# EAGLE design V0p2_Main_PCB2 (EAGLE 7.1.0)
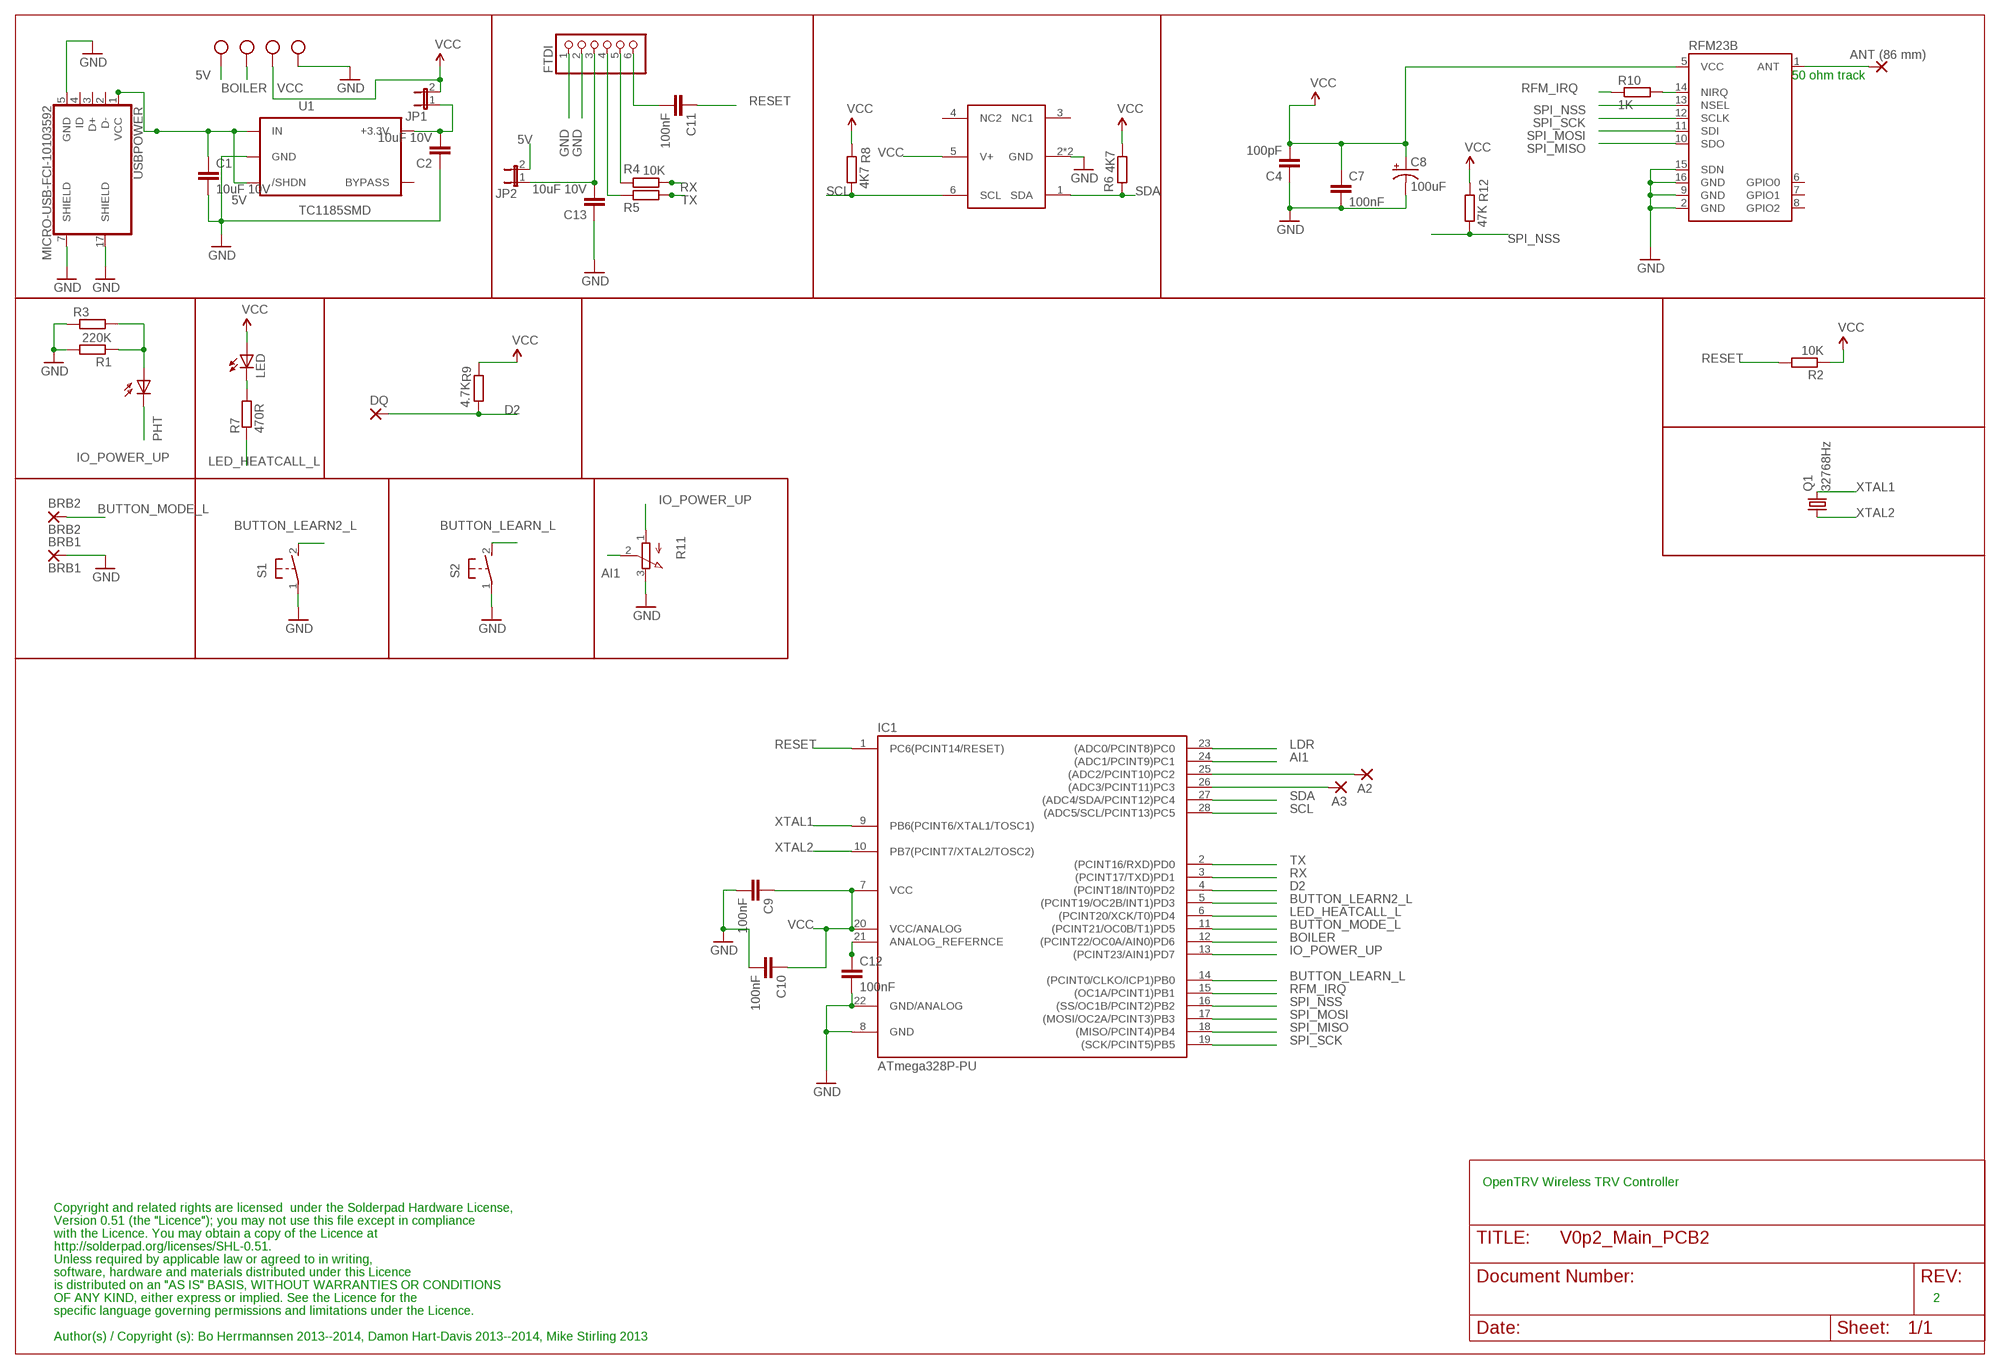
[diagram p0: schematic, sheet 1]

## Parts
A2  2,15/1,0  [2,15/1,0]
A3  2,15/1,0  [2,15/1,0]
ANT1  ANT (86 mm)  2,15/1,0  [2,15/1,0]
BRB1  BRB1  2,15/1,0  [2,15/1,0]
BRB2  BRB2  2,15/1,0  [2,15/1,0]
C1  10uF 10V  C-EUC0603  [C0603]
C2  10uF 10V  C-EUC0603  [C0603]
C4  100pF  C-EUC0603  [C0603]
C7  100nF  C-EUC0603  [C0603]
C8  100uF  CAP_POL1206  [EIA3216]
C9  100nF  C-EUC0603  [C0603]
C10  100nF  C-EUC0603  [C0603]
C11  100nF  C-EUC0603  [C0603]
C12  100nF  C-EUC0603  [C0603]
C13  10uF 10V  C-EUC0603  [C0603]
DQ  2,15/1,0  [2,15/1,0]
FTDI  PINHD-1X6/90  [1X06/90]
IC1  ATmega328P-PU  ATMEGA168-PU  [DIL28-3]
JP1  JP1E  [JP1]
JP2  JP1E  [JP1]
LED  LED3MM  [LED3MM]
PHT  BPX65  [BPX65]
Q1  32768Hz  MC-306  [MC-306]
R1  220K  R-EU_R0603  [R0603]
R2  10K  R-EU_R0603  [R0603]
R3  R-EU_0309/V  [0309V]
R4  10K  R-EU_R0603  [R0603]
R5  10K  R-EU_R0603  [R0603]
R6  4K7  R-EU_R0603  [R0603]
R7  470R  R-EU_R0603  [R0603]
R8  4K7  R-EU_R0603  [R0603]
R9  4.7K  R-EU_R0603  [R0603]
R10  1K  R-EU_R0603  [R0603]
R11  EVUE2A  [EVUE]
R12  47K  R-EU_R0603  [R0603]
RFM23B  RFM23B  [RFM23-XXX-S1]
S1  31-XX  [B3F-31XX]
S2  31-XX  [B3F-31XX]
U1  TC1185SMD  [TC1185]
U$4  SHT21  [SHT21]
USBPOWER  MICRO-USB-FCI-10103592  [MICRO-USB-FCI-10103592]
X1  W237-102  [SCREWTERMINAL]
X2  W237-102  [SCREWTERMINAL]

## Nets
5V [supply]: C1.1 JP2.2 U1.1(IN) U1.3(/SHDN) USBPOWER.1(VCC) X1.2
AI1: IC1.24((ADC1/PCINT9)PC1) R11.2(S)
BOILER: IC1.12((PCINT22/OC0A/AIN0)PD6) X1.1
BUTTON_LEARN2_L: IC1.5((PCINT19/OC2B/INT1)PD3) S1.2(S)
BUTTON_LEARN_L: IC1.14((PCINT0/CLKO/ICP1)PB0) S2.2(S)
BUTTON_MODE_L: BRB2.1(P) IC1.11((PCINT21/OC0B/T1)PD5)
D2: DQ.1(P) IC1.4((PCINT18/INT0)PD2) R9.1
GND [supply]: BRB1.1(P) C1.2 C2.1 C4.1 C7.2 C8.C(-) C9.2 C10.2 C12.2 C13.1 FTDI.1 FTDI.2 IC1.8(GND) IC1.22(GND/ANALOG) R1.2 R3.1 R11.3(E) RFM23B.2(GND) RFM23B.9(GND) RFM23B.15(SDN) RFM23B.16(GND) S1.1(P) S2.1(P) U1.2(GND) U$4.2(GND) U$4.P$1(GND) USBPOWER.5(GND) USBPOWER.7(SHIELD) USBPOWER.17(SHIELD) X2.2
IO_POWER_UP [supply]: IC1.13((PCINT23/AIN1)PD7) PHT.K(C) R11.1(A)
LDR: IC1.23((ADC0/PCINT8)PC0) PHT.A R1.1 R3.2
LED_HEATCALL_L: IC1.6((PCINT20/XCK/T0)PD4) R7.1
N$1: C11.2 FTDI.6
N$3: FTDI.4 R5.2
N$5: FTDI.5 R4.2
N$6 [supply]: C12.1 IC1.21(ANALOG_REFERNCE)
N$7: R10.2 RFM23B.14(NIRQ)
N$8 [supply]: C2.2 JP1.1 U1.5(+3.3V)
N$11 [supply]: C13.2 FTDI.3 JP2.1
N$13: LED.K(C) R7.2
N$24: A2.1(P) IC1.25((ADC2/PCINT10)PC2)
N$25: A3.1(P) IC1.26((ADC3/PCINT11)PC3)
N$31 [ant]: ANT1.1(P) RFM23B.1(ANT)
RESET: C11.1 IC1.1(PC6(PCINT14/RESET)) R2.2
RFM_IRQ: IC1.15((OC1A/PCINT1)PB1) R10.1
RX: IC1.3((PCINT17/TXD)PD1) R4.1
SCL: IC1.28((ADC5/SCL/PCINT13)PC5) R8.1 U$4.6(SCL)
SDA: IC1.27((ADC4/SDA/PCINT12)PC4) R6.2 U$4.1(SDA)
SPI_MISO: IC1.18((MISO/PCINT4)PB4) RFM23B.10(SDO)
SPI_MOSI: IC1.17((MOSI/OC2A/PCINT3)PB3) RFM23B.11(SDI)
SPI_NSS: IC1.16((SS/OC1B/PCINT2)PB2) R12.1 RFM23B.13(NSEL)
SPI_SCK: IC1.19((SCK/PCINT5)PB5) RFM23B.12(SCLK)
TX: IC1.2((PCINT16/RXD)PD0) R5.1
VCC [supply]: C4.2 C7.1 C8.A(+) C9.1 C10.1 IC1.7(VCC) IC1.20(VCC/ANALOG) JP1.2 LED.A R2.1 R6.1 R8.2 R9.2 R12.2 RFM23B.5(VCC) U$4.5(V+) X2.1
XTAL1: IC1.9(PB6(PCINT6/XTAL1/TOSC1)) Q1.4
XTAL2: IC1.10(PB7(PCINT7/XTAL2/TOSC2)) Q1.1
Unconnected: RFM23B.6(GPIO0) RFM23B.7(GPIO1) RFM23B.8(GPIO2) U1.4(BYPASS) U$4.3(NC1) U$4.4(NC2) USBPOWER.2(D-) USBPOWER.3(D+) USBPOWER.4(ID)

## Notes on the sheet
- 50 ohm track
- OpenTRV Wireless TRV Controller
- Copyright and related rights are licensed  under the Solderpad Hardware License,
- Version 0.51 (the "Licence"); you may not use this file except in compliance
- with the Licence. You may obtain a copy of the Licence at
- http://solderpad.org/licenses/SHL-0.51.
- Unless required by applicable law or agreed to in writing,
- software, hardware and materials distributed under this Licence
- is distributed on an "AS IS" BASIS, WITHOUT WARRANTIES OR CONDITIONS
- OF ANY KIND, either express or implied. See the Licence for the | 2
- specific language governing permissions and limitations under the Licence.
- Author(s) / Copyright (s): Bo Herrmannsen 2013--2014, Damon Hart-Davis 2013--2014, Mike Stirling 2013

## Library data of the parts
A2 A3 ANT1 BRB1 BRB2 DQ = wirepad:2,15/1,0: THROUGH-HOLE PAD
C1 C2 C4 C7 C9-C13 = resistor:C-EU: CAPACITOR, European symbol
C8 = SparkFun-Passives:CAP_POL: Capacitor Polarized These are standard SMD and PTH capacitors. Normally 10uF, 47uF, and 100uF in electrolytic and tantalum varieties. Always verify the external diameter of the through hole cap, it varies with capacity, voltage, and manufacturer. The EIA devices should be standard.
FTDI = pinhead:PINHD-1X6: PIN HEADER
IC1 = Arduino-AVR:ATMEGA168-PU
JP1 JP2 = jumper:JP1E: JUMPER
LED = adafruit:LED: LED OSRAM: - CHIPLED LG R971, LG N971, LY N971, LG Q971, LY Q971, LO R971, LY R971 LH N974, LH R974 LS Q976, LO Q976, LY Q976 LO Q996 - Hyper CHIPLED LW Q18S LB Q993, LB Q99A, LB R99A - SideLED LS A670, LO A670, LY A670, LG A670, LP A670 LB A673, LV A673, LT A673, LW A673 LH A674 LY A675 LS A676, LA A676, LO A676, LY A676, LW A676 LS A679, LY A679, LG A679 - Hyper Micro SIDELED® LS Y876, LA Y876, LO Y876, LY Y876 LT Y87S - SmartLED LW L88C, LW L88S LB L89C, LB L89S, LG L890 LS L89K, LO L89K, LY L89K LS L896, LA L896, LO L896, LY L896 - TOPLED LS T670, LO T670, LY T670, LG T670, LP T670 LSG T670, LSP T670, LSY T670, LOP T670, LYG T670 LG T671, LOG T671, LSG T671 LB T673, LV T673, LT T673, LW T673 LH T674 LS T676, LA T676, LO T676, LY T676, LB T676, LH T676, LSB T676, LW T676 LB T67C, LV T67C, LT T67C, LS T67K, LO T67K, LY T67K, LW E67C LS E67B, LA E67B, LO E67B, LY E67B, LB E67C, LV E67C, LT E67C LW T67C LS T679, LY T679, LG T679 LS T770, LO T770, LY T770, LG T770, LP T770 LB T773, LV T773, LT T773, LW T773 LH T774 LS E675, LA E675, LY E675, LS T675 LS T776, LA T776, LO T776, LY T776, LB T776 LHGB T686 LT T68C, LB T68C - Hyper Mini TOPLED® LB M676 - Mini TOPLED Santana® LG M470 LS M47K, LO M47K, LY M47K Source: http://www.osram.convergy.de/
PHT = opto-trans-siemens:BPX65: PHOTO DIODE; MPN: BPX65.; OC_FARNELL: 327451; OC_NEWARK: 06WX2764
Q1 = crystal:MC-306: kHz RANGE CRYSTAL UNIT SMD Source: MC-306_405_406_E07X.PDF Homepage <http://www.epsontoyocom.co.jp>; MPN: MC-306 60.0KHZ 100PPM ,12.5PF; OC_FARNELL: 1278040; OC_NEWARK: 31M5576
R1-R10 R12 = resistor:R-EU_: RESISTOR, European symbol
R11 = pot:EVU: 9 mm Square Rotary Potentiometers Source: Panasonic
RFM23B = SparkFun-RF:RFM23B
S1 S2 = adafruit:31-XX: OMRON SWITCH Now with beefier pads!
U1 = 3.3VREG:TC1185
U$4 = SHT21:SHT21: Tempsensor RS No: 709-8868 MRF No: TMP112AIDRLT
USBPOWER = micro-usb-fci-10103592:MICRO-USB-FCI-10103592: Micro USB B Connector RS No: 714-2334 MRF No: 10103592-0001LF
X1 X2 = screwterminal:W237-102: Screw terminal 3.5mm Pitch RS No: 710-0444 MRF No:1776275-2; MPN: 237-102; OC_FARNELL: unknown; OC_NEWARK: 70K9898

## Net classes
0 default: width 0.203 mm
1 supply: width 0.406 mm, clearance 0.203 mm
2 ant: width 2.184 mm

## Board
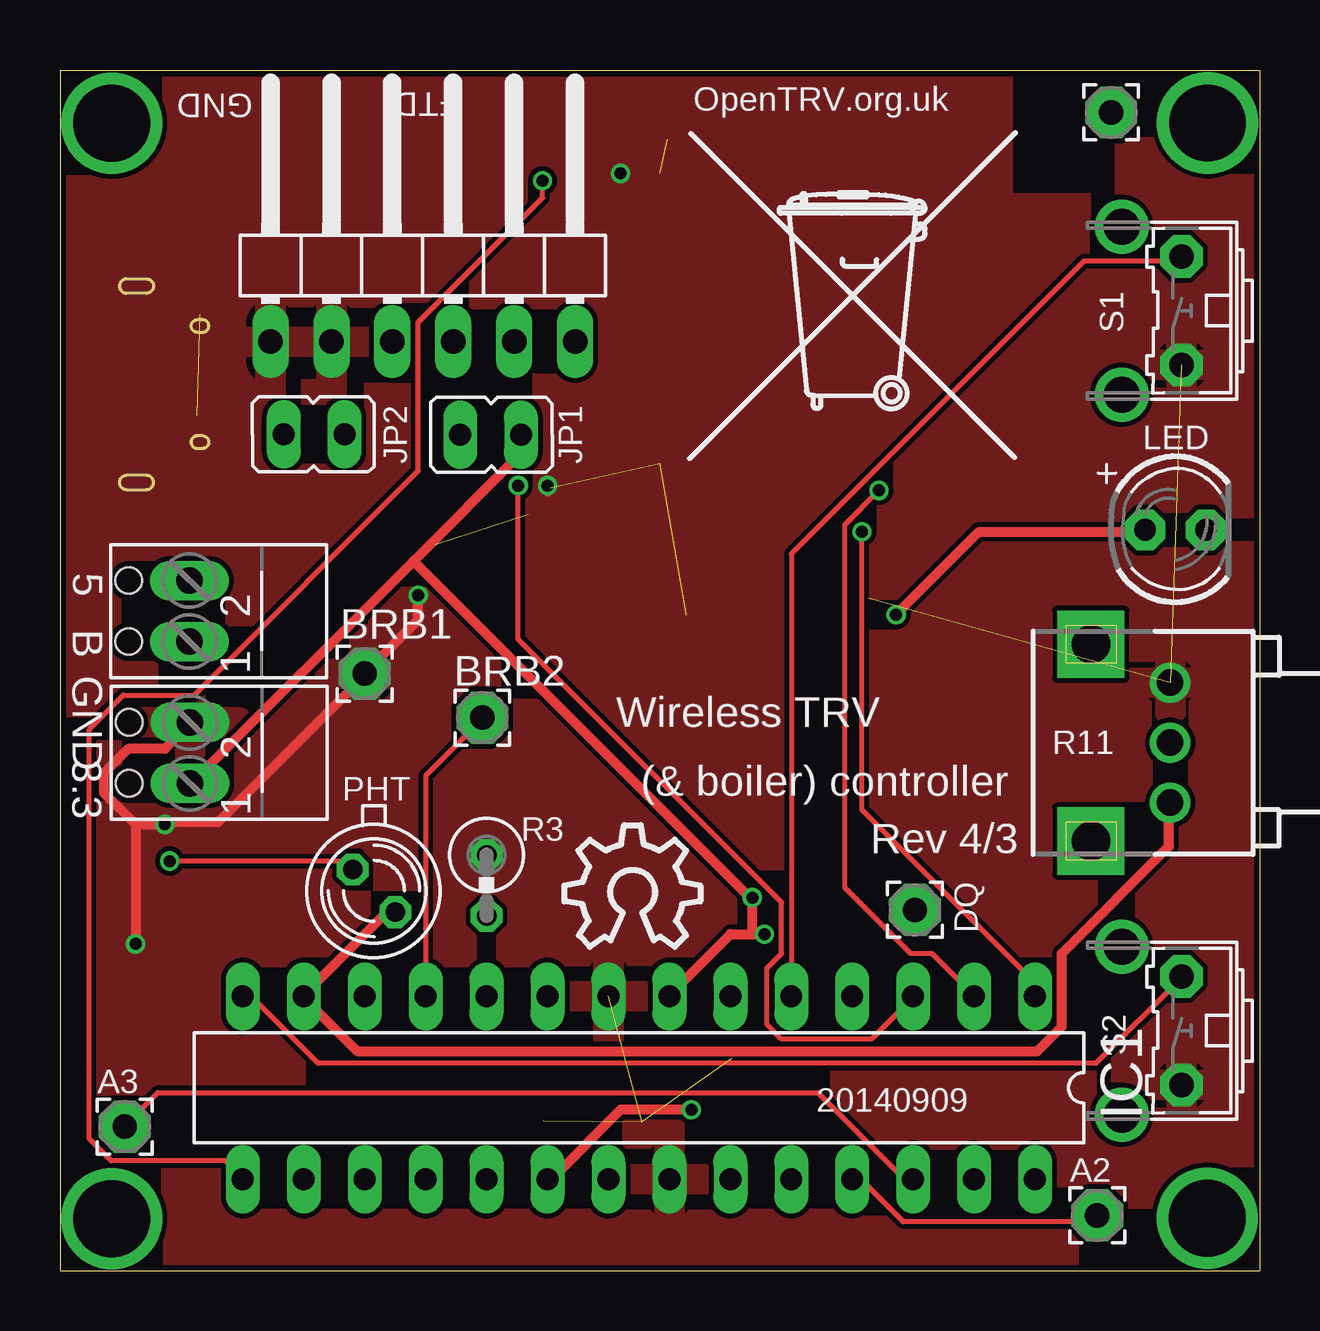
[diagram p1: board, top side]
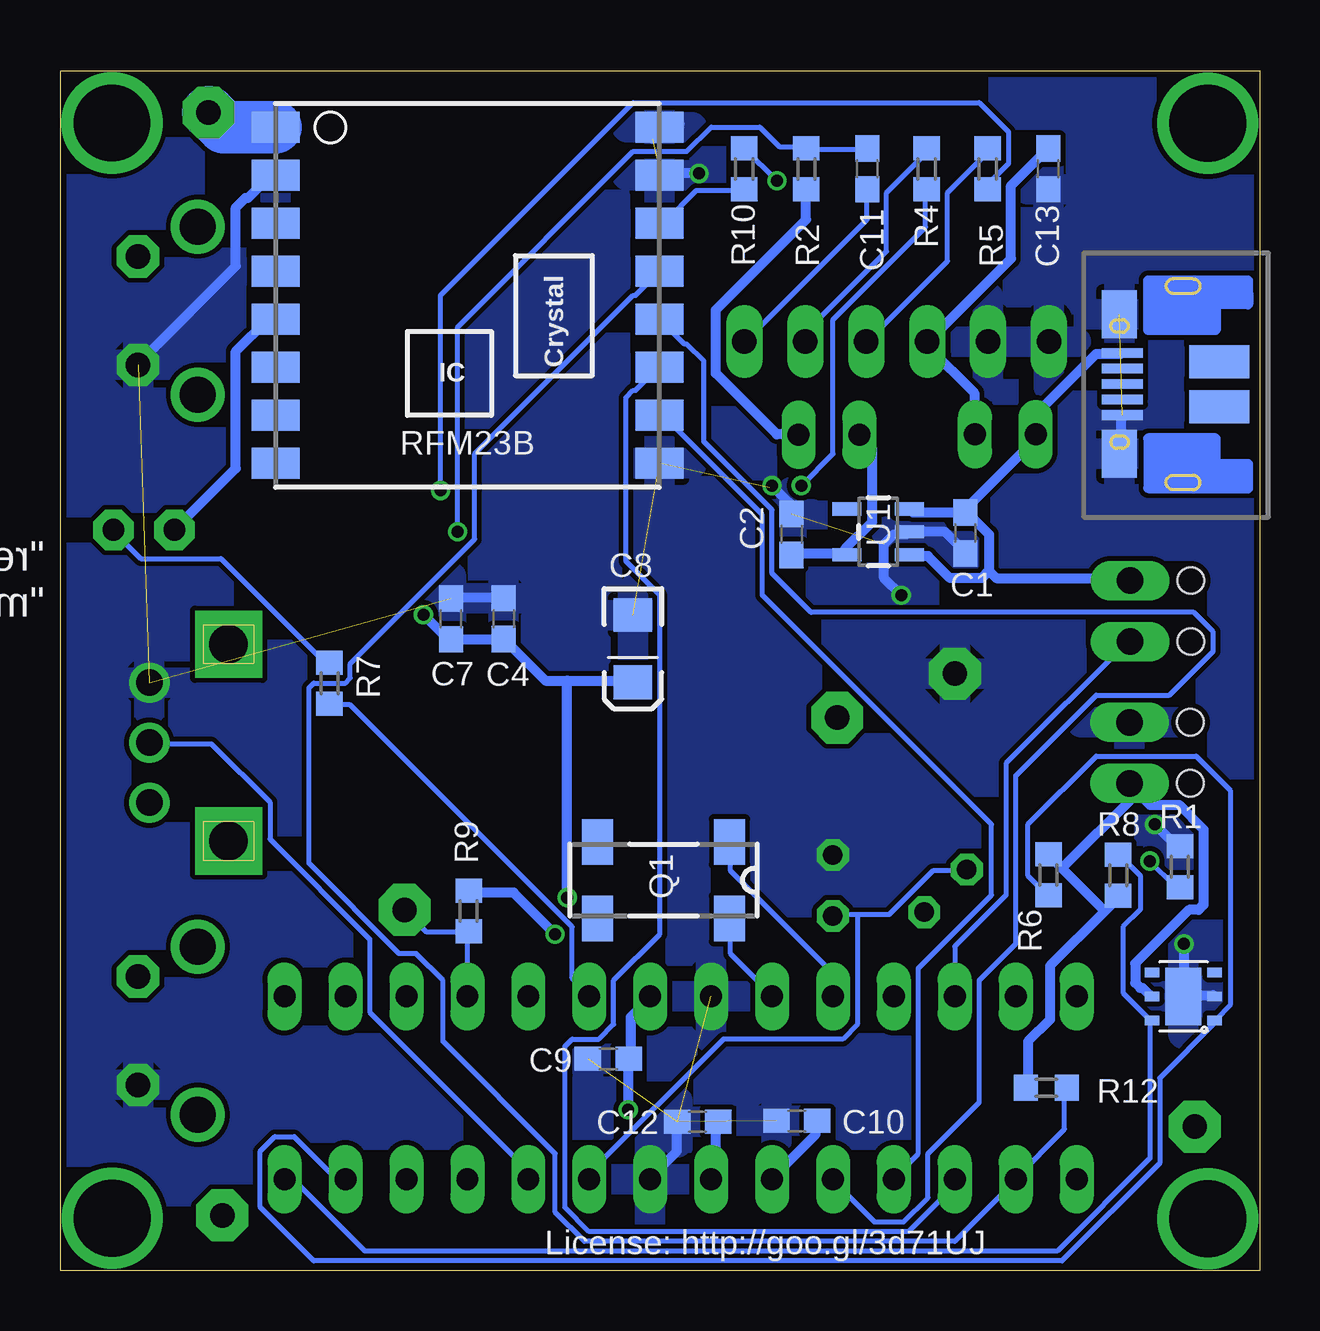
[diagram p2: board, bottom side, seen from below]

Size 50 x 50 mm. Coordinates in mm from the lower left corner, seen from the top.
Outline: 0,0 50,0 50,50 0,50 0,0
Copper layers (1*16): Top 0.035mm / dielectric 1.5mm / Bottom 0.035mm
Design rules "PMServicesStd *": minimum track width 8mil, minimum drill 0.5mm, track to track 8mil, track to pad 8mil, pad to pad 8mil, via to via 8mil, smd to smd 0mil, copper to edge 10mil, drill to drill 10mil, minimum pad ring 10mil, minimum via ring 6mil, stop-mask expansion 2mil, vias tented up to drill 100mil, thermal gap 10mil

### Footprints (pad centres in the part's own frame; a part is rotated, then mirrored left to right if it is on the bottom)
2,15/1,0 = drill 1.016 pad 2.159 octagon: 1 0,0
C0603 = smd 1.1 x 1: 1 -0.85,0; 2 0.85,0
EIA3216 = smd 1.4 x 1.6: A 1.4,0; C -1.4,0
1X06/90 = drill 1.016 long: 1 -6.35,-3.81; 2 -3.81,-3.81; 3 -1.27,-3.81; 4 1.27,-3.81; 5 3.81,-3.81; 6 6.35,-3.81
DIL28-3 = drill 0.914 long: 1 -16.51,-3.81; 2 -13.97,-3.81; 3 -11.43,-3.81; 4 -8.89,-3.81; 5 -6.35,-3.81; 6 -3.81,-3.81; 7 -1.27,-3.81; 8 1.27,-3.81; 9 3.81,-3.81; 10 6.35,-3.81; 11 8.89,-3.81; 12 11.43,-3.81; 13 13.97,-3.81; 14 16.51,-3.81; 15 16.51,3.81; 16 13.97,3.81; 17 11.43,3.81; 18 8.89,3.81; 19 6.35,3.81; 20 3.81,3.81; 21 1.27,3.81; 22 -1.27,3.81; 23 -3.81,3.81; 24 -6.35,3.81; 25 -8.89,3.81; 26 -11.43,3.81; 27 -13.97,3.81; 28 -16.51,3.81
JP1 = drill 0.914 long: 1 0,-1.27; 2 0,1.27
LED3MM = drill 0.914 pad 1.676 octagon: A -1.27,0; K 1.27,0
BPX65 = drill 0.813 octagon: A -0.889,-0.889; K 0.889,0.889
MC-306 = smd 1.3 x 1.9: 1 -2.75,-1.6; 2 2.75,-1.6; 3 2.75,1.6; 4 -2.75,1.6
R0603 = smd 1 x 1.1: 1 -0.85,0; 2 0.85,0
0309V = drill 0.813 octagon: 1 -1.27,0; 2 1.27,0
EVUE = drill 1.1 pad 1.676: 1 0,-2.5; 2 0,0; 3 0,2.5 | drill 1.6 pad 2.8 square: M1 -3.3,4.1; M2 -3.3,-4.1
RFM23-XXX-S1 = smd 2 x 1.3: 1 -8,7; 2 -8,5; 3 -8,3; 4 -8,1; 5 -8,-1; 6 -8,-3; 7 -8,-5; 8 -8,-7; 9 8,-7; 10 8,-5; 11 8,-3; 12 8,-1; 13 8,1; 14 8,3; 15 8,5; 16 8,7
B3F-31XX = drill 1.016 pad 1.778 octagon: 1 -2.261,-1.245; 2 2.261,-1.245 | drill 1.499 pad 2.032: 3 -3.505,1.245; 4 3.505,1.245
TC1185 = smd 0.55 x 1.2: 1 -0.95,-1.3; 2 0,-1.3; 3 0.95,-1.3; 4 0.95,1.3; 5 -0.95,1.3
SHT21 = smd 0.4 x 0.6: 1 -1,-1.3; 2 0,-1.3; 3 1,-1.3; 4 1,1.3; 5 0,1.3; 6 -1,1.3 | smd 2.4 x 1.5: P$1 0,0
MICRO-USB-FCI-10103592 = smd 0.4 x 1.71: 1 3.84,2.51; 2 3.19,2.51; 3 2.54,2.51; 4 1.89,2.51; 5 1.24,2.51 | smd 2 x 1.46: 7 -0.36,2.64; 17 5.44,2.64 | smd 1.375 x 2.5: 11 1.603,-1.52; 12 3.478,-1.52
SCREWTERMINAL = drill 1.1 long: 1 -1.27,-1.27; 2 1.27,-1.27 | hole 1.1: -1.27,1.27; 1.27,1.27

### Placement (x,y rotation side)
A2  43.23,2.31 0 top
A3  2.7,6 0 top
ANT1  43.81,48.26 0 top
BRB1  12.7,24.87 0 top
BRB2  17.6,23.04 180 top
C1  12.27,30.74 270 bottom
C2  19.51,30.68 270 bottom
C4  31.51,27.17 270 bottom
C7  33.7,27.16 90 bottom
C8  26.12,25.92 270 bottom
C9  27.15,8.82 180 bottom
C10  19.28,6.24 180 bottom
C11  16.35,45.91 270 bottom
C12  23.42,6.21 180 bottom
C13  8.8,45.91 90 bottom
DQ  35.64,15.03 0 top
FTDI  15.12,42.52 0 top
IC1  24.13,7.62 180 top
JP1  17.95,34.83 270 top
JP2  10.59,34.85 90 top
LED  46.5,30.86 0 top
PHT  13.09,15.82 270 top
Q1  24.84,16.27 180 bottom
R1  3.32,16.83 90 bottom
R2  18.89,45.91 90 bottom
R3  17.78,16.05 270 top
R4  13.87,45.91 90 bottom
R5  11.33,45.91 90 bottom
R6  8.79,16.49 270 bottom
R7  38.77,24.47 90 bottom
R8  5.89,16.47 270 bottom
R9  32.96,14.99 90 bottom
R10  21.48,45.91 270 bottom
R11  46.27,22 0 top
R12  8.89,7.62 180 bottom
RFM23B  33.02,40.64 0 bottom
S1  45.5,40 90 top
S2  45.5,10 90 top
U1  15.89,30.79 90 bottom
U$1  [OSHW_10X200_NOTEXT]  21.02,13.49 0 top
U$2  [TONNE]  32.88,37.88 0 top
U$4  3.17,11.43 90 bottom
USBPOWER  3.2,34.4 90 bottom
X1  4.13,27.48 90 top
X2  4.15,21.57 90 top

### Tracks (layer width: path | path; a pad name or v marks a point on that pad's centre or on a via)
5V
  Bottom 0.406: C1.1 12.29,31.6 14.43,31.6 14.53,31.7 U1.3 | 11.28,29.16 11.58,28.85 12.9,28.85 13.82,29.77 14.53,29.77 U1.1 | 11.28,29.16 11.28,30.68 12.09,31.5 C1.1 | USBPOWER.1 5.79,38.2 6.81,38.2 9.25,35.76 9.25,34.85 JP2.2 9.35,34.65 12.09,31.9 12.09,31.7 C1.1 | 11.28,29.16 10.97,28.85 5.49,28.85 X1.2
AI1
  Bottom 0.203: IC1.24 30.48,4.17 37.08,10.77 37.08,13.82 41.25,17.98 41.25,19.51 43.69,21.95 46.23,21.95 R11.2
BOILER
  Bottom 0.203: IC1.12 12.7,13.51 10.57,15.65 10.57,21.13 5.49,26.21 X1.1
BUTTON_LEARN2_L
  Top 0.203: IC1.5 30.48,29.87 42.67,42.06 46.63,42.06 46.74,42.16 S1.2
BUTTON_LEARN_L
  Top 0.203: IC1.14 7.62,11.38 8.03,11.38 10.77,8.64 43.18,8.64 46.74,12.19 S2.2
BUTTON_MODE_L
  Top 0.203: IC1.11 15.24,20.62 17.58,22.96 BRB2.1
D2
  Bottom 0.203: IC1.4 33.02,14.12 R9.1 33.12,14.12 34.75,14.12 35.56,14.94 DQ.1
GND  (via drill 0.5)  (10 unrouted)
  Top 0.406: 3.15,18.59 v4.37,18.59 4.47,18.69 6.6,18.69 12.6,24.69 BRB1.1 12.7,24.89 14.94,27.13 v14.94,28.14 | 3.15,18.59 1.83,19.91 1.83,20.73 2.85,21.74 4.37,21.74 5.38,22.76 X2.2 | 3.15,18.59 v3.15,13.61 | 20.34,32.47 v20.32,32.72 20.42,32.61
  Bottom 0.406: 41.05,45.62 RFM23B.2 41.25,45.62 42.16,44.7 42.27,44.7 42.67,44.3 42.67,41.86 46.74,37.8 S1.1 | U$4.2 1.93,11.48 3.15,11.48 U$4.P$1 3.15,11.68 v3.15,13.61 | USBPOWER.7 5.79,34.14 5.79,35.56 USBPOWER.5 | C1.2 12.29,29.97 13.11,30.79 14.53,30.79 U1.2 14.73,30.68 15.24,30.68 15.65,30.28 15.65,28.85 v14.94,28.14 | C7.2 33.63,28.04 31.6,28.04 C4.1 | v4.37,18.59 3.56,17.78 3.35,17.78 R1.2 | C12.2 24.28,6.2 24.28,4.98 25.4,3.86 IC1.22 | v20.32,32.72 19.61,32 19.61,31.6 C2.1 | v23.37,45.72 24.99,45.72 RFM23B.15 | RFM23B.16 25.3,47.14 RFM23B.16 | 24.69,47.45 RFM23B.16 | RFM23B.16 25.09,47.85 RFM23B.16 | RFM23B.16 | 24.59,47.45 RFM23B.16 | RFM23B.16 24.18,47.65 24.2,47.64 24.18,47.85 RFM23B.16 | RFM23B.16 | RFM23B.16 25.09,47.65 RFM23B.16 | RFM23B.16 25.4,48.06 RFM23B.16 | RFM23B.16 24.89,47.85 RFM23B.16 | RFM23B.16 25.09,47.75 RFM23B.16 | RFM23B.16 24.28,48.06 24.28,47.64
  pour Bottom: 0,0 50,0 50,50 44.6,50 44.6,44.28 39.09,44.27 39.09,50 0,50
  pour Top: 0,50 0,0 50,0 50,50 44.6,50 44.6,44.28 39.09,44.27 39.09,50
IO_POWER_UP
  Top 0.406: PHT.K 13.92,14.83 13.51,14.83 10.16,11.48 IC1.13 10.26,11.28 12.39,9.14 40.74,9.14 41.76,10.16 41.76,13.21 46.23,17.68 46.23,19.41 R11.1
LDR  (via drill 0.5)
  Top 0.203: v4.57,17.07 11.89,17.07 12.19,16.76 PHT.A
  Bottom 0.203: v4.57,17.07 3.56,16.05 3.35,16.05 R1.1 | 16.76,14.83 15.44,14.83 13.61,16.66 12.29,16.66 PHT.A | 16.76,14.83 17.78,14.83 R3.2 | IC1.23 27.94,4.06 22.35,9.65 17.37,9.65 16.76,10.26 16.76,14.83
LED_HEATCALL_L
  Bottom 0.203: R7.1 38.71,23.57 37.9,23.57 28.65,14.33 28.65,12.19 27.94,11.48 IC1.6
N$1
  Bottom 0.203: C11.2 16.36,45.01 16.36,43.79 21.44,38.71 FTDI.6
N$3
  Bottom 0.203: R5.2 11.38,46.74 11.38,46.53 13.01,44.91 13.01,42.06 16.36,38.71 FTDI.4
N$4  (via drill 3.2)
  other vias: 2.16,47.81
N$5
  Bottom 0.203: R4.2 13.92,46.74 13.92,46.53 15.54,44.91 15.54,42.47 18.9,39.12 18.9,38.71 FTDI.5
N$6
  Bottom 0.406: C12.1 22.66,6.2 22.66,4.06 22.86,3.86 IC1.21
N$7
  Bottom 0.203: R10.2 21.54,45.01 23.47,45.01 24.79,43.69 24.99,43.69 RFM23B.14
N$8
  Bottom 0.406: C2.2 19.51,29.87 17.27,29.87 U1.5 17.27,30.07 16.15,31.19 16.15,34.24 16.66,34.75 JP1.1
N$11
  Bottom 0.406: C13.2 8.84,46.74 10.36,45.21 10.36,42.16 13.82,38.71 FTDI.3 13.82,38.51 11.89,36.58 11.89,34.85 JP2.1
N$12  (via drill 3.2)
  other vias: 47.83,2.19
N$13
  Bottom 0.203: R7.2 38.81,25.4 39.01,25.4 43.28,29.67 46.63,29.67 47.75,30.79 LED.K
N$19  (via drill 3.2)
  other vias: 47.83,47.82
N$22  (via drill 3.2)
  other vias: 2.16,2.16
N$24
  Top 0.203: IC1.25 33.02,3.76 33.43,3.76 35.15,2.03 42.98,2.03 43.18,2.23 A2.1
N$25
  Top 0.203: IC1.26 35.56,3.86 35.15,3.86 31.6,7.42 4.06,7.42 2.74,6.1 A3.1
N$31
  Bottom 2.184: RFM23B.1 41.05,47.65 43.18,47.65 43.79,48.26 ANT1.1
RESET  (via drill 0.5)
  Top 0.203: v33.43,30.79 33.43,19.2 40.64,11.99 IC1.1
  Bottom 0.203: C11.1 16.36,46.74 18.8,46.74 R2.2 18.9,46.84 20.02,46.84 20.83,47.65 22.86,47.65 23.88,46.63 26.11,46.63 33.43,39.32 v33.43,30.79
RFM_IRQ  (via drill 0.5)
  Top 0.203: v20.12,45.41 20.12,44.7 14.94,39.52 14.94,33.33 5.59,23.98 2.64,23.98 1.22,22.55 1.22,5.49 2.13,4.57 6.91,4.57 7.62,3.86 IC1.15
  Bottom 0.203: v20.12,45.41 21.44,46.74 R10.1
RX  (via drill 0.5)
  Top 0.203: v19.1,32.72 19.1,26.31 30.07,15.34 30.07,13.21 29.46,12.6 29.46,10.26 30.07,9.65 33.83,9.65 35.56,11.38 IC1.3
  Bottom 0.203: v19.1,32.72 17.78,34.04 17.78,39.62 13.92,43.48 13.92,45.01 R4.1
SCL
  Bottom 0.203: R8.1 5.79,17.27 4.98,16.46 4.98,15.04 5.69,14.33 5.69,11.58 4.57,10.46 U$4.6 4.57,10.36 4.57,4.67 8.43,0.81 37.29,0.81 40.23,3.76 40.64,3.76 IC1.28
SDA
  Bottom 0.203: R6.2 8.84,15.65 9.65,16.46 9.65,18.59 6.81,21.44 2.64,21.44 1.22,20.02 1.22,11.07 1.83,10.46 U$4.1 1.83,10.36 4.17,8.03 4.17,4.47 8.23,0.41 39.42,0.41 41.66,2.64 41.66,4.98 41.05,5.59 40.23,5.59 38.51,3.86 38.1,3.86 IC1.27
SPI_MISO
  Bottom 0.203: RFM23B.10 24.99,35.56 24.79,35.56 20.73,31.5 20.73,28.14 11.18,18.59 11.18,15.65 14.22,12.6 14.22,4.88 15.24,3.86 IC1.18
SPI_MOSI
  Bottom 0.203: IC1.17 12.7,3.56 14.63,1.63 27.94,1.63 28.96,2.64 28.96,9.35 28.65,9.65 27.53,9.65 26.92,10.26 26.92,12.09 24.99,14.02 24.99,28.14 26.42,29.57 26.42,36.37 26.11,36.68 26.01,36.68 25.09,37.59 RFM23B.11
SPI_NSS
  Bottom 0.203: R12.1 8.13,7.62 8.13,5.89 10.16,3.86 IC1.16 10.16,3.76 12.7,1.22 28.14,1.22 29.36,2.44 29.36,4.88 34.04,9.55 34.04,12.09 35.15,13.21 35.87,13.21 39.62,16.97 39.62,24.28 39.42,24.49 38.1,24.49 37.9,24.69 37.9,25.3 32.72,30.48 32.72,34.04 26.11,40.64 26.01,40.64 25.09,41.55 RFM23B.13
SPI_SCK
  Bottom 0.203: RFM23B.12 24.99,39.62 23.98,38.61 23.88,38.61 23.16,37.9 23.16,34.54 20.32,31.7 20.32,29.06 18.69,27.43 2.74,27.43 1.93,26.62 1.93,25.81 3.76,23.98 6.81,23.98 10.16,20.62 10.16,13.61 11.68,12.09 11.68,7.01 13.82,4.88 13.82,3.05 14.83,2.03 16.05,2.03 17.78,3.76 IC1.19
TX  (via drill 0.5)
  Top 0.203: v34.14,32.51 32.72,31.09 32.72,15.95 35.46,13.21 36.37,13.21 38.1,11.48 IC1.2
  Bottom 0.203: v34.14,32.51 34.14,40.64 26.11,48.67 11.68,48.67 10.46,47.45 10.46,46.13 11.28,45.31 11.28,45.11 R5.1
VCC  (via drill 0.5)
  Top 0.406: 14.73,29.57 5.49,20.32 X2.1 | 14.73,29.57 19.2,34.04 19.2,34.75 JP1.2 | 28.85,14.02 27.94,14.02 25.4,11.48 IC1.7 | 28.85,14.02 v29.36,14.02 | v26.31,6.71 23.37,6.71 20.52,3.86 20.32,3.86 IC1.20 | 28.85,14.02 v28.85,15.54 28.75,15.54 14.73,29.57 | v34.85,27.33 38.3,30.79 45.21,30.79 LED.A
  Bottom 0.406: R2.1 18.9,45.01 18.9,43.79 22.66,40.03 22.66,37.39 20.12,34.85 19.3,34.85 JP1.2 | 6.45,14.99 5.89,15.54 R8.2 | 6.45,14.99 8.74,12.7 8.74,10.46 9.65,9.55 9.65,7.62 R12.2 | 6.45,14.99 8.23,16.76 | 8.23,16.76 8.74,17.27 R6.1 | U$4.5 4.57,11.48 4.88,11.79 4.98,11.79 5.18,11.99 5.18,12.8 2.95,15.04 2.54,15.04 2.34,15.24 2.34,18.39 3.35,19.41 4.57,19.41 5.38,20.22 X2.1 5.18,19.81 8.23,16.76 | RFM23B.5 41.05,39.62 41.35,39.62 42.67,38.3 42.67,33.43 45.21,30.89 LED.A | 28.85,24.59 29.77,24.59 31.39,26.21 C4.2 31.6,26.31 33.63,26.31 C7.1 33.83,26.31 v34.85,27.33 | 28.85,24.59 26.21,24.59 C8.A | C10.1 18.49,6.2 18.49,5.69 20.32,3.86 IC1.20 | IC1.7 25.4,11.38 26.21,10.57 26.21,8.84 C9.1 26.31,8.64 v26.31,6.71 | v29.36,14.02 31.09,15.75 32.92,15.75 R9.2 | v28.85,15.54 28.85,24.59
XTAL1
  Bottom 0.203: Q1.4 22.05,14.63 22.05,13.21 20.32,11.48 IC1.9
XTAL2
  Bottom 0.203: IC1.10 17.78,12.39 22.05,16.66 22.05,17.78 Q1.1

### Text on the board
bPlace: License: http://goo.gl/3d71UJ
tNames: GND | OpenTRV.org.uk | 5 | B | GND | Wireless TRV | 3.3 | (& boiler) controller | Rev 4/3 | 20140909
bNames: "replace milling with slot drilling if rqd" / "min 2.1mm x 1.8mm"